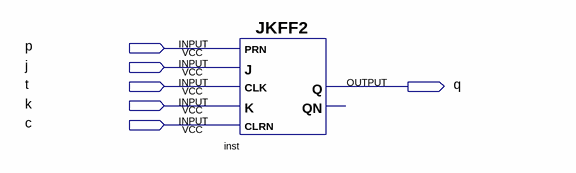
[diagram p0: schematic sheet]
// Quartus schematic 1210102.bdf as structural Verilog: 1 symbols, 6 pins
module \1210102  (
  input  p,
  input  j,
  input  t,
  input  k,
  input  c,
  output q
);

  JKFF2 inst (.K(k), .CLRN(c), .CLK(t), .PRN(p), .J(j), .Q(q));  // open: QN
endmodule
